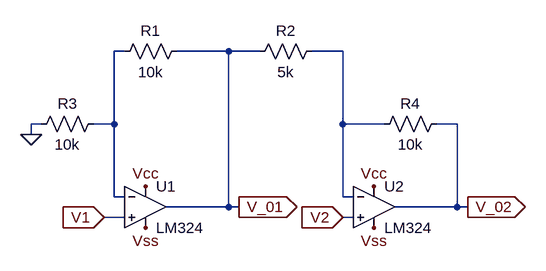
[diagram p0: schematic Lab_1_Circ_3_-Vin.asc]
Lab_1_Circ_3_-Vin.asc, the LTspice schematic file:
Version 4
SHEET 1 1560 680
WIRE 192 -320 176 -320
WIRE 352 -320 272 -320
WIRE 400 -320 352 -320
WIRE 528 -320 480 -320
WIRE 64 -208 48 -208
WIRE 176 -208 176 -320
WIRE 176 -208 144 -208
WIRE 528 -208 528 -320
WIRE 592 -208 528 -208
WIRE 704 -208 672 -208
WIRE 48 -192 48 -208
WIRE 176 -96 176 -208
WIRE 192 -96 176 -96
WIRE 528 -96 528 -208
WIRE 544 -96 528 -96
WIRE 352 -80 352 -320
WIRE 352 -80 256 -80
WIRE 368 -80 352 -80
WIRE 704 -80 704 -208
WIRE 704 -80 608 -80
WIRE 720 -80 704 -80
WIRE 192 -64 160 -64
WIRE 544 -64 528 -64
FLAG 48 -192 0
FLAG 224 -112 Vcc
FLAG 224 -48 Vss
FLAG 720 -80 V_02
IOPIN 720 -80 Out
FLAG 160 -64 V1
IOPIN 160 -64 In
FLAG 368 -80 V_01
IOPIN 368 -80 Out
FLAG 576 -112 Vcc
FLAG 576 -48 Vss
FLAG 528 -64 V2
IOPIN 528 -64 In
SYMBOL OpAmps\\opamp2 224 -144 R0
SYMATTR InstName U1
SYMATTR Value LM324
SYMBOL res 176 -304 R270
WINDOW 0 32 56 VTop 2
WINDOW 3 0 56 VBottom 2
SYMATTR InstName R1
SYMATTR Value 10k
SYMBOL res 384 -304 R270
WINDOW 0 32 56 VTop 2
WINDOW 3 0 56 VBottom 2
SYMATTR InstName R2
SYMATTR Value 5k
SYMBOL res 160 -224 R90
WINDOW 0 0 56 VBottom 2
WINDOW 3 32 56 VTop 2
SYMATTR InstName R3
SYMATTR Value 10k
SYMBOL res 576 -192 R270
WINDOW 0 32 56 VTop 2
WINDOW 3 0 56 VBottom 2
SYMATTR InstName R4
SYMATTR Value 10k
SYMBOL OpAmps\\opamp2 576 -144 R0
SYMATTR InstName U2
SYMATTR Value LM324

The netlist it stands for:
* Lab_1_Circ_3_-Vin.asc
XU1 V1 N001 Vcc Vss V_01 LM324  ; pins In+ In- V+ V- OUT
R1 N001 V_01 10k
R2 V_01 N002 5k
R3 N001 0 10k
R4 N002 V_02 10k
XU2 V2 N002 Vcc Vss V_02 LM324  ; pins In+ In- V+ V- OUT
.backanno
.end